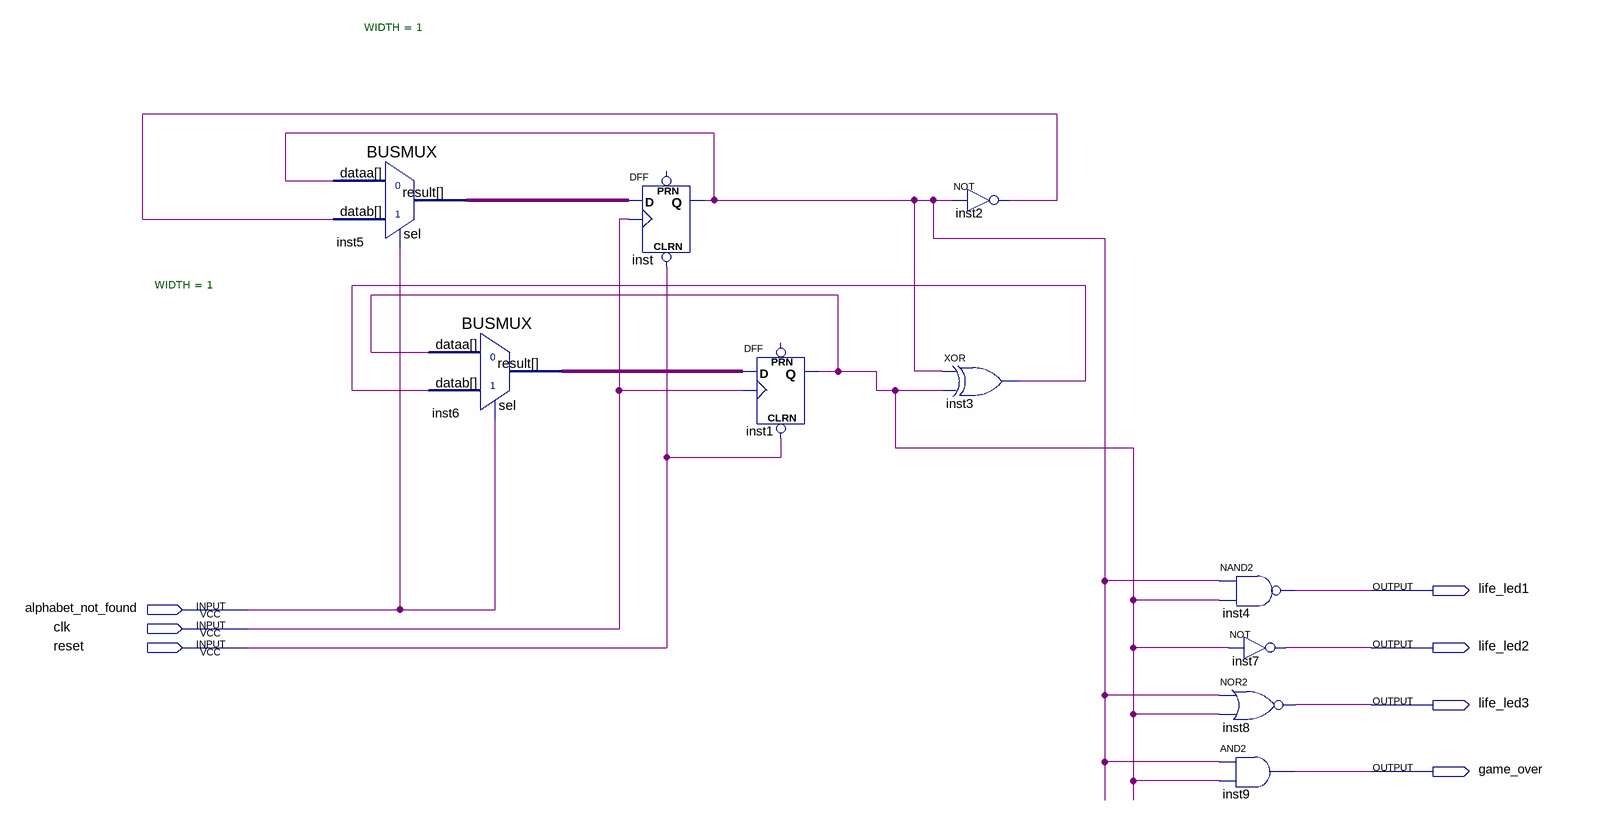
[diagram p0: schematic sheet]
// Quartus schematic life_register.bdf as structural Verilog: 10 symbols, 7 pins
module life_register (
  input  alphabet_not_found,
  input  clk,
  input  reset,
  output life_led1,
  output life_led2,
  output life_led3,
  output game_over
);

  wire inst1_q, inst2_out, inst3_out, inst5_result, inst6_result, inst_q;

  BUSMUX #(.WIDTH(1)) inst5 (.datab(inst2_out), .sel(alphabet_not_found), .dataa(inst_q), .result(inst5_result));
  BUSMUX #(.WIDTH(1)) inst6 (.datab(inst3_out), .sel(alphabet_not_found), .dataa(inst1_q), .result(inst6_result));
  DFF inst (.CLRN(reset), .CLK(clk), .D(inst5_result), .Q(inst_q));  // open: PRN
  DFF inst1 (.CLRN(reset), .CLK(clk), .D(inst6_result), .Q(inst1_q));  // open: PRN
  not inst2 (inst2_out, inst_q);
  xor inst3 (inst3_out, inst_q, inst1_q);
  nand inst4 (life_led1, inst_q, inst1_q);
  not inst7 (life_led2, inst1_q);
  nor inst8 (life_led3, inst_q, inst1_q);
  and inst9 (game_over, inst_q, inst1_q);
endmodule
